# EasyEDA Pro project schematics.epro

# Schematic Schematic1
Board Name: Board1; Create Date: 2026-02-02; Page Name: P1; Project Name: Composite board for TDA2450/2451; Schematic Name: Schematic1; Update Date: 2026-02-23; Company: EasyEDA.com; Page Size: A4; Version: V1.0
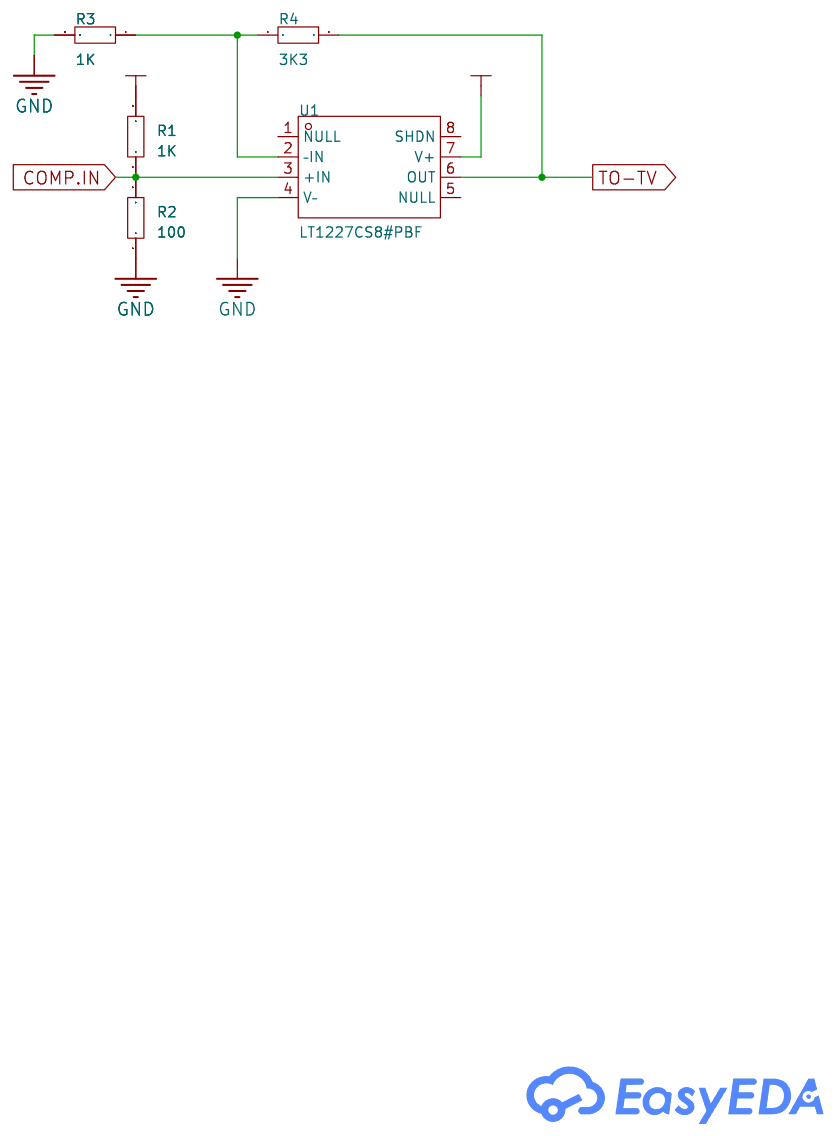
[diagram p0: schematic sheet]

## Parts
R1  1K  [R0603]
R2  100  [R0603]
R3  1K  [R0603]
R4  3K3  [R0603]
U1  LT1227CS8#PBF  [SO-8_L4.9-W3.9-P1.27-LS6.0-BL]

## Library data of the parts
R1-R4 = Res_0603: Supplier Footprint: 0603
U1 = LT1227CS8#PBF: Number of Channels:1 -3dB Bandwidth:140MHz Slew Rate:1100V/us Differential Phase:0.01deg Vos - Input Offset Voltage:10000uV Ib - Input Bias Current:10mA Operating Temperature:0℃~+70℃ Operating Temperature:0℃~+70℃ Input Offset Voltage Drift(Vos TC):10uV/℃; LCSC Part Name: 140MHz 视频电流反馈放大器; Supplier Part: C663203; Manufacturer: ADI(亚德诺); Supplier Footprint: SO-8; JLCPCB Part Class: Extended Part; Datasheet: https://item.szlcsc.com/datasheet/LT1227CS8%2523PBF/692703.html; Supplier: LCSC; Number of Channels: 1; -3dB Bandwidth: 140MHz; Slew Rate: 1100V/us; Differential Phase: 0.01deg; Vos - Input Offset Voltage: 10000uV; Ib - Input Bias Current: 10mA; Operating Temperature: 0℃~+70℃; Input Offset Voltage Drift(Vos TC): 10uV/℃; Common Mode Rejection Ratio (CMRR): 62dB; Quiescent Current: 15000uA

## Nets
+12V: R1.2 U1.7(V+)
GND: R2.1 R3.2 U1.4(V–)
COMP.IN: R1.1 R2.2 U1.3(+IN)
TO-TV: R4.2 U1.6(OUT)
Net-(R3-1): R3.1 R4.1 U1.2(–IN)

Not connected (* = marked no-connect by the designer): U1 1(NULL) 5(NULL) 8(SHDN)
